# EAGLE design Light_Shield (EAGLE 6.5.0)
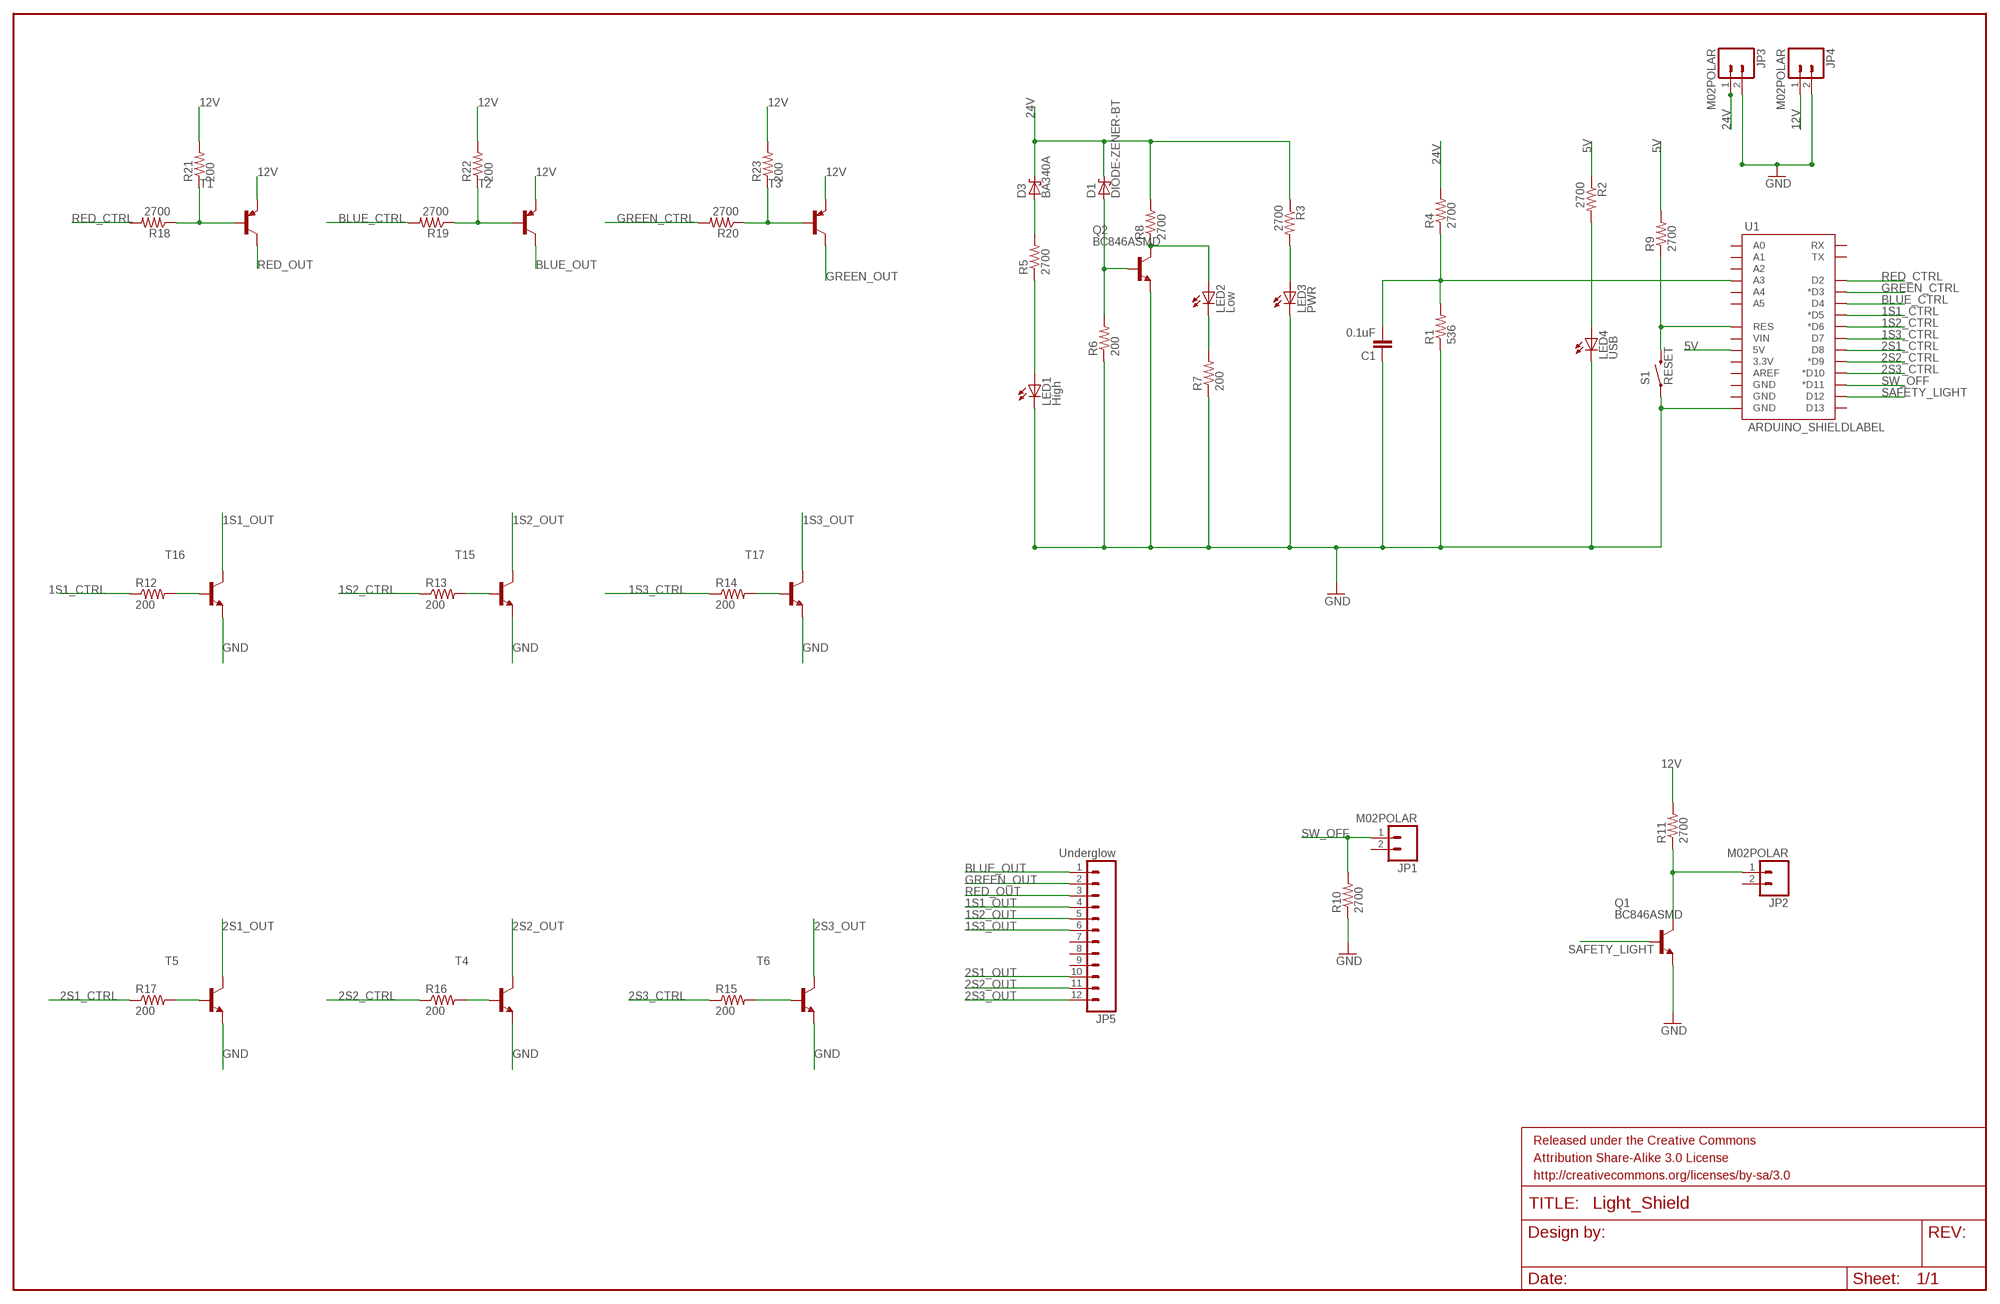
[diagram p0: schematic, sheet 1]

## Parts
C1  0.1uF  CAP0402-CAP  [0402-CAP]
D1  DIODE-ZENER-BT  SMF5.0AT1  [SOD123FL]
D3  BA340A  SMF5.0AT1  [SOD123FL]
FRAME1  FRAME-LEDGER  [CREATIVE_COMMONS]
JP1  M02POLAR  [MOLEX-1X2]
JP2  M02POLAR  [MOLEX-1X2]
JP3  M02POLAR  [MOLEX-1X2]
JP4  M02POLAR  [MOLEX-1X2]
JP5  Underglow  M12LOCK_LONGPADS  [1X12_LOCK_LONGPADS]
LED1  High  LEDSML0603  [SML0603]
LED2  Low  LEDSML0603  [SML0603]
LED3  PWR  LEDSML0603  [SML0603]
LED4  USB  LEDSML0603  [SML0603]
Q1  BC846ASMD  [SOT23]
Q2  BC846ASMD  [SOT23]
R1  536  RESISTOR0402-RES  [0402-RES]
R2  2700  RESISTOR0603  [0603-RES]
R3  2700  RESISTOR0603  [0603-RES]
R4  2700  RESISTOR0603  [0603-RES]
R5  2700  RESISTOR0603  [0603-RES]
R6  200  RESISTOR0603  [0603-RES]
R7  200  RESISTOR0603-RES  [0603-RES]
R8  2700  RESISTOR0603-RES  [0603-RES]
R9  2700  RESISTOR0603  [0603-RES]
R10  2700  RESISTOR0603  [0603-RES]
R11  2700  RESISTOR0603  [0603-RES]
R12  200  RESISTOR0603  [0603-RES]
R13  200  RESISTOR0603  [0603-RES]
R14  200  RESISTOR0603  [0603-RES]
R15  200  RESISTOR0603  [0603-RES]
R16  200  RESISTOR0603  [0603-RES]
R17  200  RESISTOR0603  [0603-RES]
R18  2700  RESISTOR0603  [0603-RES]
R19  2700  RESISTOR0603  [0603-RES]
R20  2700  RESISTOR0603  [0603-RES]
R21  200  RESISTOR0603  [0603-RES]
R22  200  RESISTOR0603  [0603-RES]
R23  200  RESISTOR0603  [0603-RES]
S1  RESET  SWITCH-MOMENTARY-2PTH  [TACTILE-PTH]
T1  -PNP-TO220V  [TO220V]
T2  -PNP-TO220V  [TO220V]
T3  -PNP-TO220V  [TO220V]
T4  -NPN-TO220V  [TO220V]
T5  -NPN-TO220V  [TO220V]
T6  -NPN-TO220V  [TO220V]
T15  -NPN-TO220V  [TO220V]
T16  -NPN-TO220V  [TO220V]
T17  -NPN-TO220V  [TO220V]
U1  ARDUINO_SHIELDLABEL  [DUEMILANOVE_SHIELD]

## Nets
1S1_CTRL: R12.1 U1.D5(*D5)
1S1_OUT: JP5.4 T16.2(C)
1S2_CTRL: R13.1 U1.D6(*D6)
1S2_OUT: JP5.5 T15.2(C)
1S3_CTRL: R14.1 U1.D7
1S3_OUT: JP5.6 T17.2(C)
2S1_CTRL: R17.1 U1.D8
2S1_OUT: JP5.10 T5.2(C)
2S2_CTRL: R16.1 U1.D9(*D9)
2S2_OUT: JP5.11 T4.2(C)
2S3_CTRL: R15.1 U1.D10(*D10)
2S3_OUT: JP5.12 T6.2(C)
5V: R2.1 R9.2 U1.5V
12V: JP4.1 R11.2 R21.2 R22.2 R23.2 T1.3(E) T2.3(E) T3.3(E)
24V: D1.C D3.C JP3.1 R3.1 R4.2 R8.2
BLUE_CTRL: R19.2 U1.D4
BLUE_OUT: JP5.1 T2.2(C)
GND: C1.1 JP3.2 JP4.2 LED1.C LED3.C LED4.C Q1.2(E) Q2.2(E) R1.1 R6.1 R7.1 R10.1 S1.1 T4.3(E) T5.3(E) T6.3(E) T15.3(E) T16.3(E) T17.3(E) U1.GND@0(GND)
GREEN_CTRL: R20.2 U1.D3(*D3)
GREEN_OUT: JP5.2 T3.2(C)
N$1: C1.2 R1.2 R4.1 U1.A3
N$2: LED3.A R3.2
N$3: LED2.A Q2.3(C) R8.1
N$4: D1.A Q2.1(B) R6.2
N$5: LED4.A R2.2
N$6: JP2.1 Q1.3(C) R11.1
N$7: D3.A R5.2
N$8: LED1.A R5.1
N$9: R18.1 R21.1 T1.1(B)
N$10: LED2.C R7.2
N$11: R17.2 T5.1(B)
N$12: R9.1 S1.3 U1.RES
N$13: R16.2 T4.1(B)
N$14: R15.2 T6.1(B)
N$15: R14.2 T17.1(B)
N$16: R13.2 T15.1(B)
N$17: R12.2 T16.1(B)
N$18: R19.1 R22.1 T2.1(B)
N$19: R20.1 R23.1 T3.1(B)
RED_CTRL: R18.2 U1.D2
RED_OUT: JP5.3 T1.2(C)
SAFETY_LIGHT: Q1.1(B) U1.D12
SW_OFF: JP1.1 R10.2 U1.D11(*D11)
Unconnected: JP1.2 JP2.2 JP5.7 JP5.8 JP5.9 U1.3.3V U1.A0 U1.A1 U1.A2 U1.A4 U1.A5 U1.AREF U1.D13 U1.GND@1(GND) U1.GND@2(GND) U1.RX U1.TX U1.VIN

## Library data of the parts
C1 = SparkFun-Capacitors:CAP: Capacitor Standard 0603 ceramic capacitor, and 0.1" leaded capacitor.
D1 D3 = diode:SMF5.0AT1: 200 W Transient Voltage Suppressor Source: Data sheet <http://www.onsemi.com/pub_link/Collateral/SMF5.0AT1-D.PDF>
FRAME1 = SparkFun-Aesthetics:FRAME-LEDGER: Schematic Frame Standard 11x14 US Ledger frame
JP1-JP4 = SparkFun-Connectors:M02: Standard 2-pin 0.1" header. Use with - straight break away headers ( PRT-00116) - right angle break away headers (PRT-00553) - swiss pins (PRT-00743) - machine pins (PRT-00117) - female headers (PRT-00115) Molex polarized connector foot print use with: PRT-08233 with associated crimp pins and housings. 2.54_SCREWTERM for use with PRT-10571. 3.5mm Screw Terminal footprints for PRT-08084 5mm Screw Terminal footprints for use with PRT-08433
JP5 = SparkFun-Connectors:M12: Header 12 Standard 12-pin 0.1" header. Use with straight break away headers (SKU : PRT-00116), right angle break away headers (PRT-00553), swiss pins (PRT-00743), machine pins (PRT-00117), and female headers (PRT-00115).
LED1-LED4 = led:LED: LED OSRAM: - CHIPLED LG R971, LG N971, LY N971, LG Q971, LY Q971, LO R971, LY R971 LH N974, LH R974 LS Q976, LO Q976, LY Q976 LO Q996 - Hyper CHIPLED LW Q18S LB Q993, LB Q99A, LB R99A - SideLED LS A670, LO A670, LY A670, LG A670, LP A670 LB A673, LV A673, LT A673, LW A673 LH A674 LY A675 LS A676, LA A676, LO A676, LY A676, LW A676 LS A679, LY A679, LG A679 - Hyper Micro SIDELED® LS Y876, LA Y876, LO Y876, LY Y876 LT Y87S - SmartLED LW L88C, LW L88S LB L89C, LB L89S, LG L890 LS L89K, LO L89K, LY L89K LS L896, LA L896, LO L896, LY L896 - TOPLED LS T670, LO T670, LY T670, LG T670, LP T670 LSG T670, LSP T670, LSY T670, LOP T670, LYG T670 LG T671, LOG T671, LSG T671 LB T673, LV T673, LT T673, LW T673 LH T674 LS T676, LA T676, LO T676, LY T676, LB T676, LH T676, LSB T676, LW T676 LB T67C, LV T67C, LT T67C, LS T67K, LO T67K, LY T67K, LW E67C LS E67B, LA E67B, LO E67B, LY E67B, LB E67C, LV E67C, LT E67C LW T67C LS T679, LY T679, LG T679 LS T770, LO T770, LY T770, LG T770, LP T770 LB T773, LV T773, LT T773, LW T773 LH T774 LS E675, LA E675, LY E675, LS T675 LS T776, LA T776, LO T776, LY T776, LB T776 LHGB T686 LT T68C, LB T68C - Hyper Mini TOPLED® LB M676 - Mini TOPLED Santana® LG M470 LS M47K, LO M47K, LY M47K Source: http://www.osram.convergy.de LUXEON: - LUMILED® LXK2-PW12-R00, LXK2-PW12-S00, LXK2-PW14-U00, LXK2-PW14-V00 LXK2-PM12-R00, LXK2-PM12-S00, LXK2-PM14-U00 LXK2-PE12-Q00, LXK2-PE12-R00, LXK2-PE12-S00, LXK2-PE14-T00, LXK2-PE14-U00 LXK2-PB12-K00, LXK2-PB12-L00, LXK2-PB12-M00, LXK2-PB14-N00, LXK2-PB14-P00, LXK2-PB14-Q00 LXK2-PR12-L00, LXK2-PR12-M00, LXK2-PR14-Q00, LXK2-PR14-R00 LXK2-PD12-Q00, LXK2-PD12-R00, LXK2-PD12-S00 LXK2-PH12-R00, LXK2-PH12-S00 LXK2-PL12-P00, LXK2-PL12-Q00, LXK2-PL12-R00 Source: www.luxeon.com KINGBRIGHT: KA-3528ASYC Source: www.kingbright.com
Q1 Q2 = transistor-npn:BC846*: NPN Transistor
R1 = SparkFun-Passives:RESISTOR: Resistor Basic schematic elements and footprints for 0603, 1206, and PTH resistors.
R2-R23 = SparkFun-Resistors:RESISTOR: Resistor Basic schematic elements and footprints for 0603, 1206, and PTH resistors.
S1 = SparkFun-Electromechanical:SWITCH-MOMENTARY-2: Various NO switches- pushbuttons, reed, etc
T1-T3 = transistor:*-PNP-: PNP Transistror
T4-T6 T15-T17 = transistor:*-NPN-: NPN Transistror BF959 corrected 2008.03.06
U1 = SparkFun-Boards:ARDUINO_SHIELD: Arduino shield footprint

## Board
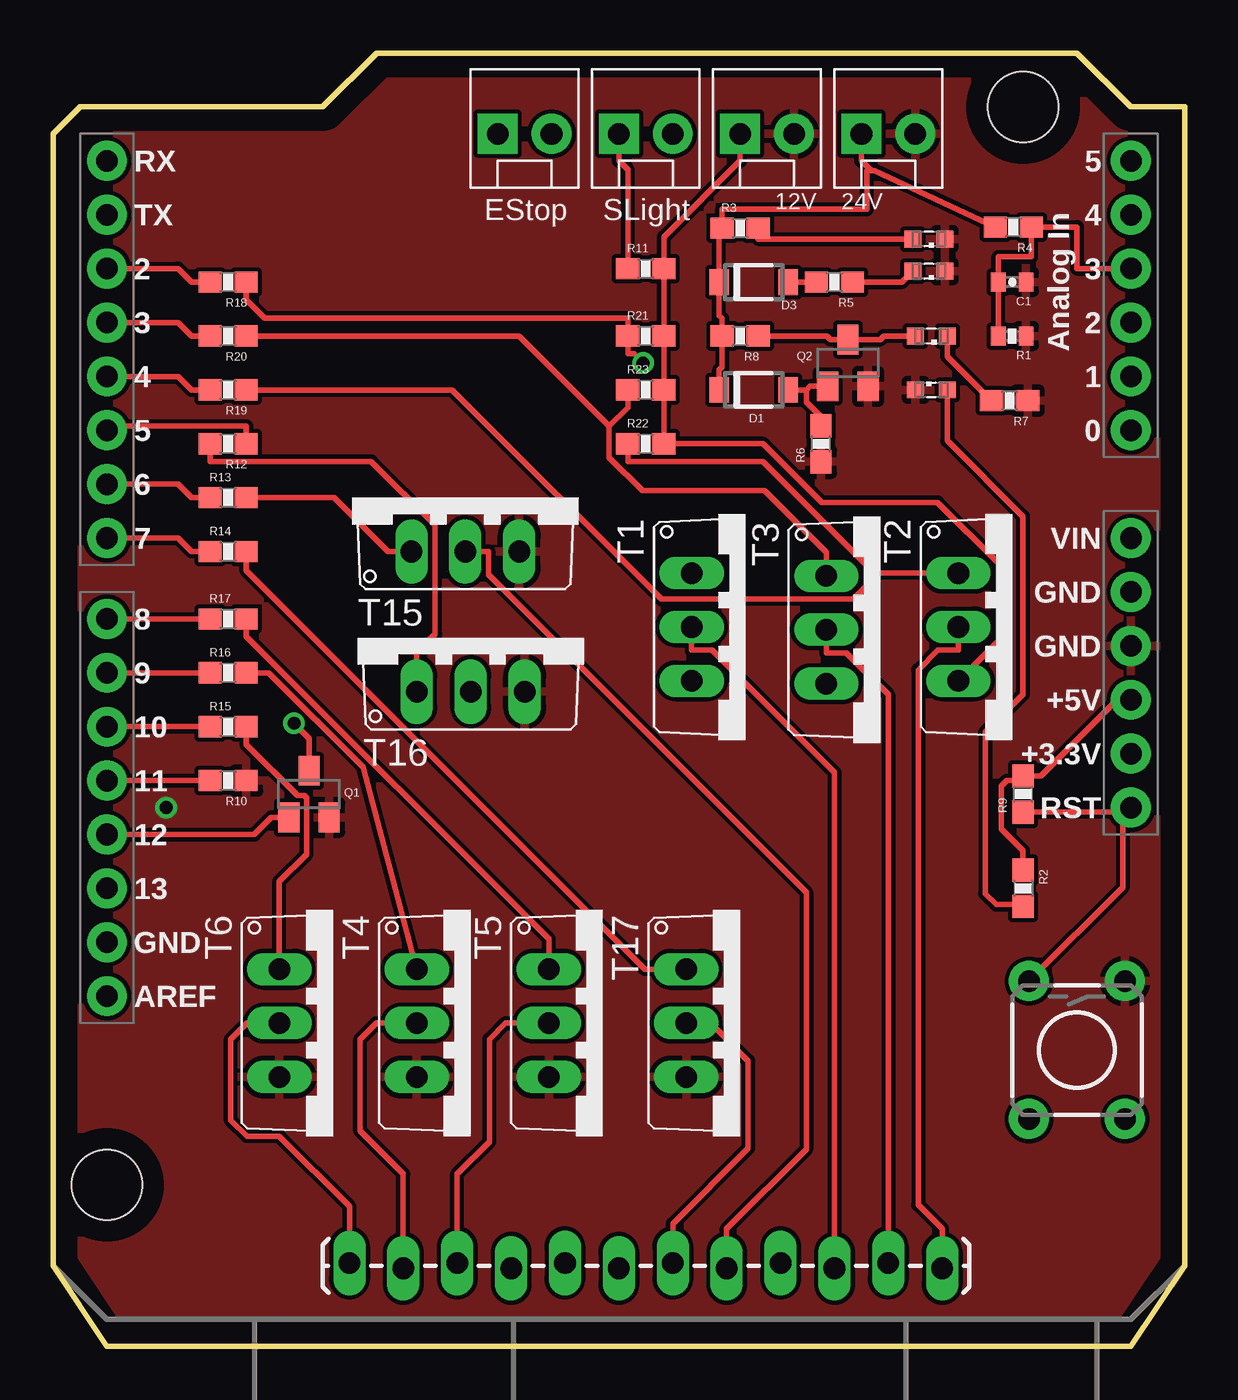
[diagram p1: board, top side]
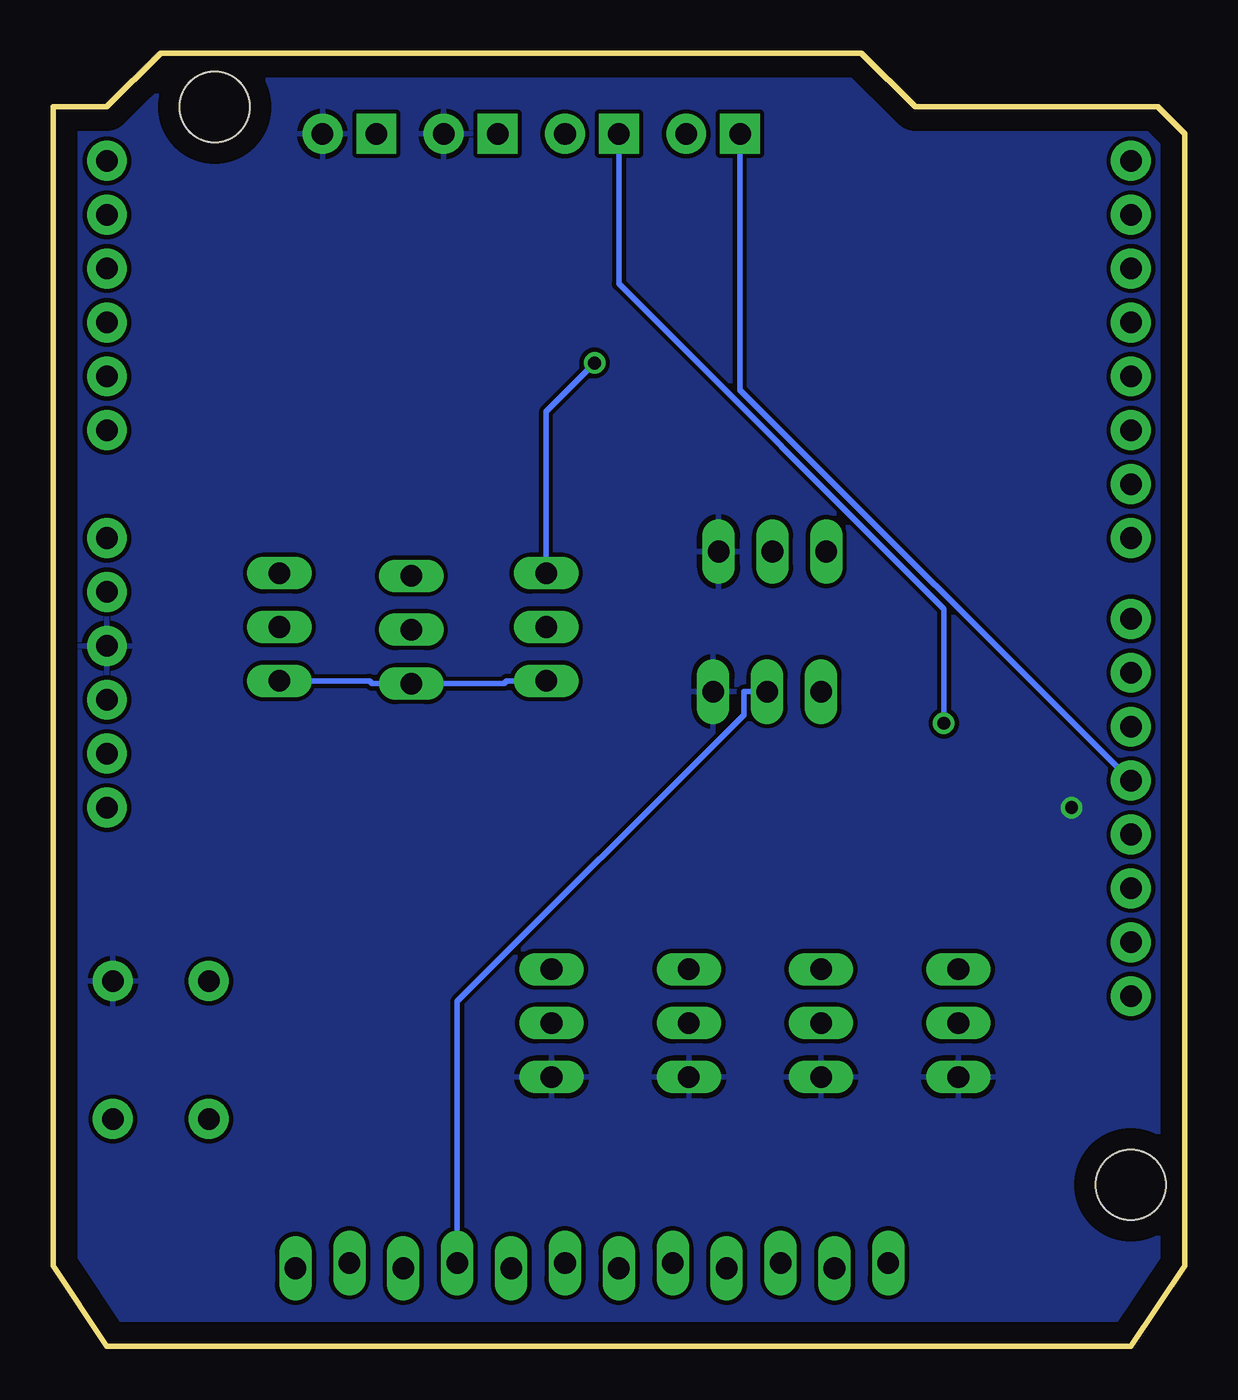
[diagram p2: board, bottom side, seen from below]

Size 53.34 x 60.96 mm. Coordinates in mm from the lower left corner, seen from the top.
Outline: 0,3.81 2.54,0 50.8,0 53.34,3.81 53.34,58.42 50.8,58.42 48.26,60.96 15.24,60.96 12.7,58.42 1.27,58.42 0,57.15 0,3.81
Copper layers (1*16): Top 0.035mm / dielectric 1.5mm / Bottom 0.035mm
Design rules "default": minimum track width 10mil, minimum drill 24mil, track to track 8mil, track to pad 8mil, pad to pad 8mil, via to via 8mil, smd to smd 8mil, copper to edge 40mil, drill to drill 8mil, minimum pad ring 10mil, minimum via ring 8mil, stop-mask expansion 4mil, vias tented up to drill 0mil, thermal gap 10mil

### Footprints (pad centres in the part's own frame; a part is rotated, then mirrored left to right if it is on the bottom)
0402-CAP = smd 0.7 x 0.9: 1 -0.65,0; 2 0.65,0
SOD123FL = smd 0.91 x 1.22: A 1.625,0; C -1.625,0
MOLEX-1X2 = drill 1.016 pad 1.88 square: 1 0,0 | drill 1.016 pad 1.88: 2 2.54,0
1X12_LOCK_LONGPADS = drill 1.016 long: 1 0,0.127; 2 2.54,-0.127; 3 5.08,0.127; 4 7.62,-0.127; 5 10.16,0.127; 6 12.7,-0.127; 7 15.24,0.127; 8 17.78,-0.127; 9 20.32,0.127; 10 22.86,-0.127; 11 25.4,0.127; 12 27.94,-0.127
SML0603 = smd 0.8 x 0.8: A 0.75,0; C -0.75,0
SOT23 = smd 1 x 1.4: 1 -0.95,-1.1; 2 0.95,-1.1; 3 0,1.1
0402-RES = smd 0.7 x 0.9: 1 -0.65,0; 2 0.65,0
0603-RES = smd 1.1 x 1: 1 -0.85,0; 2 0.85,0
TACTILE-PTH = drill 1.016 pad 1.88: 1 -3.251,2.261; 2 3.251,2.261; 3 -3.251,-2.261; 4 3.251,-2.261
TO220V = drill 1.016 long: 1 -2.54,-2.54; 2 0,-2.54; 3 2.54,-2.54
DUEMILANOVE_SHIELD = drill 1.016 pad 1.88: 3.3V 50.8,26.67; 5V 50.8,29.21; A0 50.8,41.91; A1 50.8,44.45; A2 50.8,46.99; A3 50.8,49.53; A4 50.8,52.07; A5 50.8,54.61; AREF 2.54,15.24; D2 2.54,49.53; D3 2.54,46.99; D4 2.54,44.45; D5 2.54,41.91; D6 2.54,39.37; D7 2.54,36.83; D8 2.54,33.02; D9 2.54,30.48; D10 2.54,27.94; D11 2.54,25.4; D12 2.54,22.86; D13 2.54,20.32; GND@0 50.8,31.75; GND@1 50.8,34.29; GND@2 2.54,17.78; RES 50.8,24.13; RX 2.54,54.61; TX 2.54,52.07; VIN 50.8,36.83 | hole 3.302: 45.72,57.15; 2.54,6.35

### Placement (x,y rotation side)
C1  45.21,50.16 180 top
D1  33.02,45.09 0 top
D3  33.02,50.16 0 top
FRAME1  -80.01,74.93 0 top  (outside the outline)
JP1  20.96,57.15 0 top
JP2  26.67,57.15 0 top
JP3  38.1,57.15 0 top
JP4  32.38,57.15 0 top
JP5  41.91,3.81 180 top
LED1  41.27,50.67 180 top
LED2  41.4,47.62 180 top
LED3  41.27,52.2 180 top
LED4  41.4,45.09 0 top
Q1  12.07,26.03 0 top
Q2  37.46,46.35 0 top
R1  45.21,47.62 180 top
R2  45.72,21.59 270 top
R3  32.38,52.7 0 top
R4  45.26,52.76 180 top
R5  36.83,50.16 180 top
R6  36.2,42.54 90 top
R7  45.08,44.58 180 top
R8  32.38,47.62 180 top
R9  45.72,26.03 90 top
R10  8.26,26.67 180 top
R11  27.94,50.8 0 top
R12  8.26,42.54 180 top
R13  8.26,40 0 top
R14  8.26,37.46 0 top
R15  8.26,29.21 0 top
R16  8.26,31.75 0 top
R17  8.26,34.29 0 top
R18  8.26,50.16 180 top
R19  8.26,45.09 180 top
R20  8.26,47.62 180 top
R21  27.94,47.62 0 top
R22  27.94,42.54 0 top
R23  27.94,45.09 0 top
S1  48.26,13.97 270 top
T1  32.64,33.91 270 top
T2  45.21,33.91 270 top
T3  38.99,33.78 270 top
T4  19.68,15.24 270 top
T5  25.91,15.24 270 top
T6  13.21,15.24 270 top
T15  19.43,40 0 top
T16  19.68,33.4 0 top
T17  32.38,15.24 270 top
U1  0,1.27 0 top

### Tracks (layer width: path | path; a pad name or v marks a point on that pad's centre or on a via)
1S1_CTRL
  Top 0.254: R12.1 9.11,43.38 2.73,43.38 U1.D5
1S1_OUT
  Bottom 0.254: T16.2 20.78,30.86 20.78,29.77 34.29,16.26 JP5.4
1S2_CTRL
  Top 0.254: R13.1 6.53,40 5.89,40.64 U1.D6
1S2_OUT
  Top 0.254: JP5.5 31.75,5.54 35.5,9.29 35.5,21.39 20.52,36.37 20.52,37.46 T15.2
1S3_CTRL
  Top 0.254: R14.1 6.53,37.46 5.89,38.1 U1.D7
1S3_OUT
  Top 0.254: JP5.6 29.21,5.79 32.76,9.34 32.76,13.47 30.99,15.24 T17.2
2S1_CTRL
  Top 0.254: U1.D8 R17.1
2S1_OUT
  Top 0.254: JP5.10 19.05,8.13 20.57,9.65 20.57,14.48 21.34,15.24 T5.2
2S2_CTRL
  Top 0.254: U1.D9 R16.1
2S2_OUT
  Top 0.254: JP5.11 16.51,8.13 14.48,10.16 14.48,14.48 15.24,15.24 T4.2
2S3_CTRL
  Top 0.254: U1.D10 R15.1
2S3_OUT
  Top 0.254: JP5.12 13.97,6.6 10.67,9.91 9.14,9.91 8.38,10.67 8.38,14.48 9.14,15.24 T6.2
5V
  Top 0.254: U1.5V 50.14,30.48 46.55,26.88 R9.2 45.5,26.67 44.96,26.67 44.7,26.42 44.7,24.38 45.72,23.37 R2.1
12V
  Top 0.254: JP4.1 32.38,55.88 28.79,52.29 R11.2 R21.2 R23.2 28.79,44.73 28.79,44.25 R22.2 33.46,42.54 36.23,39.78 41.69,39.78 44.55,36.92 44.55,33.25 T2.3
  Bottom 0.254: T1.3 31.95,31.37 32.08,31.24 T3.3 38.3,31.24 38.43,31.37 T2.3
24V
  Top 0.254: JP3.1 38.1,55.88 38.52,55.46 38.72,55.42 | R4.2 38.72,55.42 | D1.C 31.39,46.02 31.54,46.16 R8.2 31.54,48.45 31.39,48.59 D3.C 31.39,52.7 R3.1 31.54,53.59 38.35,53.59 38.35,55.42 38.72,55.42
BLUE_CTRL
  Top 0.254: R19.2 6.53,45.09 5.89,45.72 U1.D4
BLUE_OUT
  Top 0.254: JP5.1 41.91,5.54 40.78,6.66 40.78,31.88 41.72,32.82 42.67,32.82 T2.2
GND  (via drill 0.61 pad 1.02)
  other vias: 5.33,25.4
  pour Top: -8.89,66.04 62.23,66.04 62.23,-17.78 -11.43,-17.78 -11.43,66.04
  pour Bottom: -8.89,63.5 57.15,63.5 57.15,-7.62 -5.08,-7.62 -8.89,-7.62
GREEN_CTRL
  Top 0.254: R20.2 6.53,47.62 5.89,48.26 U1.D3
GREEN_OUT
  Top 0.254: T3.2 36.45,32.69 37.4,32.69 39.37,30.73 JP5.2
N$1
  Top 0.254: R1.2 C1.2 44.56,51.36 46.1,51.36 R4.1 48.26,52.76 48.26,50.8 U1.A3
N$2
  Top 0.254: R3.2 33.23,52.2 LED3.A
N$3
  Top 0.254: LED2.A 39.16,47.62 38.99,47.45 Q2.3 36.63,47.45 36.46,47.62 R8.1
N$4
  Top 0.254: 35.51,45.09 35.68,45.25 Q2.1 | 35.51,45.09 35.04,45.09 D1.A | 35.51,45.09 35.51,44.52 36.2,43.84 R6.2
N$5
  Top 0.254: LED4.A 42.15,42.68 45.72,39.12 45.72,30.73 43.94,28.96 43.94,21.34 44.45,20.83 45.63,20.83 R2.2
N$6  (via drill 0.61 pad 1.02)
  Top 0.254: v11.36,29.37 12.07,28.66 Q1.3 | JP2.1 26.67,55.88 27.09,55.46 R11.1
  Bottom 0.254: JP2.1 26.67,50.08 11.36,34.77 v11.36,29.37
N$7
  Top 0.254: R5.2 D3.A
N$8
  Top 0.254: R5.1 40.02,50.16 LED1.A
N$9  (via drill 0.61 pad 1.02)
  Top 0.254: v27.81,46.35 27.37,46.79 27.09,46.79 R21.1 27.09,48.45 9.98,48.45 9.11,49.34 R18.1
  Bottom 0.254: T1.1 30.1,44.07 v27.81,46.35
N$10
  Top 0.254: LED2.C 42.15,46.66 R7.2
N$11
  Top 0.254: R17.2 9.11,33.46 23.37,19.2 T5.1
N$12
  Top 0.254: 50.41,25.18 50.41,21.64 S1.3 | U1.RES 50.63,25.4 50.41,25.18 | 50.41,25.18 46.55,25.18 R9.1
N$13
  Top 0.254: T4.1 14.61,27.31 10.16,31.75 R16.2
N$14
  Top 0.254: R15.2 9.11,28.38 11.52,25.96 11.83,25.96 11.95,25.84 11.95,23.2 10.67,21.92 T6.1
N$15
  Top 0.254: T17.1 27.9,17.78 9.11,36.58 R14.2
N$16
  Top 0.254: T15.1 15.8,37.46 13.26,40 R13.2
N$17
  Top 0.254: R12.2 7.41,41.71 15,41.71 18.01,38.7 18.01,33.58 17.14,32.71 T16.1
N$18
  Top 0.254: 38.72,36.45 33.45,41.71 27.09,41.71 R22.1 | T2.1 38.72,36.45 | 38.72,36.45 38.72,36.22 37.72,35.22 28.67,35.22 18.81,45.09 R19.1
N$19
  Top 0.254: 26.21,43.37 21.96,47.62 R20.1 | 26.21,43.37 27.09,44.25 R23.1 | 26.21,43.37 26.21,41.9 27.78,40.34 33.53,40.34 36.45,37.41 T3.1
RED_CTRL
  Top 0.254: R18.2 6.53,50.16 5.89,50.8 U1.D2
RED_OUT
  Top 0.254: T1.2 30.1,32.82 31.06,32.82 36.83,27.04 JP5.3
SAFETY_LIGHT
  Top 0.254: Q1.1 10.29,24.93 9.48,24.13 U1.D12
SW_OFF
  Top 0.254: U1.D11 R10.2
  Bottom 0.254: U1.D11 20.96,45.09 JP1.1

### Text on the board
tNames: 24V | 12V | EStop | SLight